# EAGLE design headset-btmodule (EAGLE 6.4)
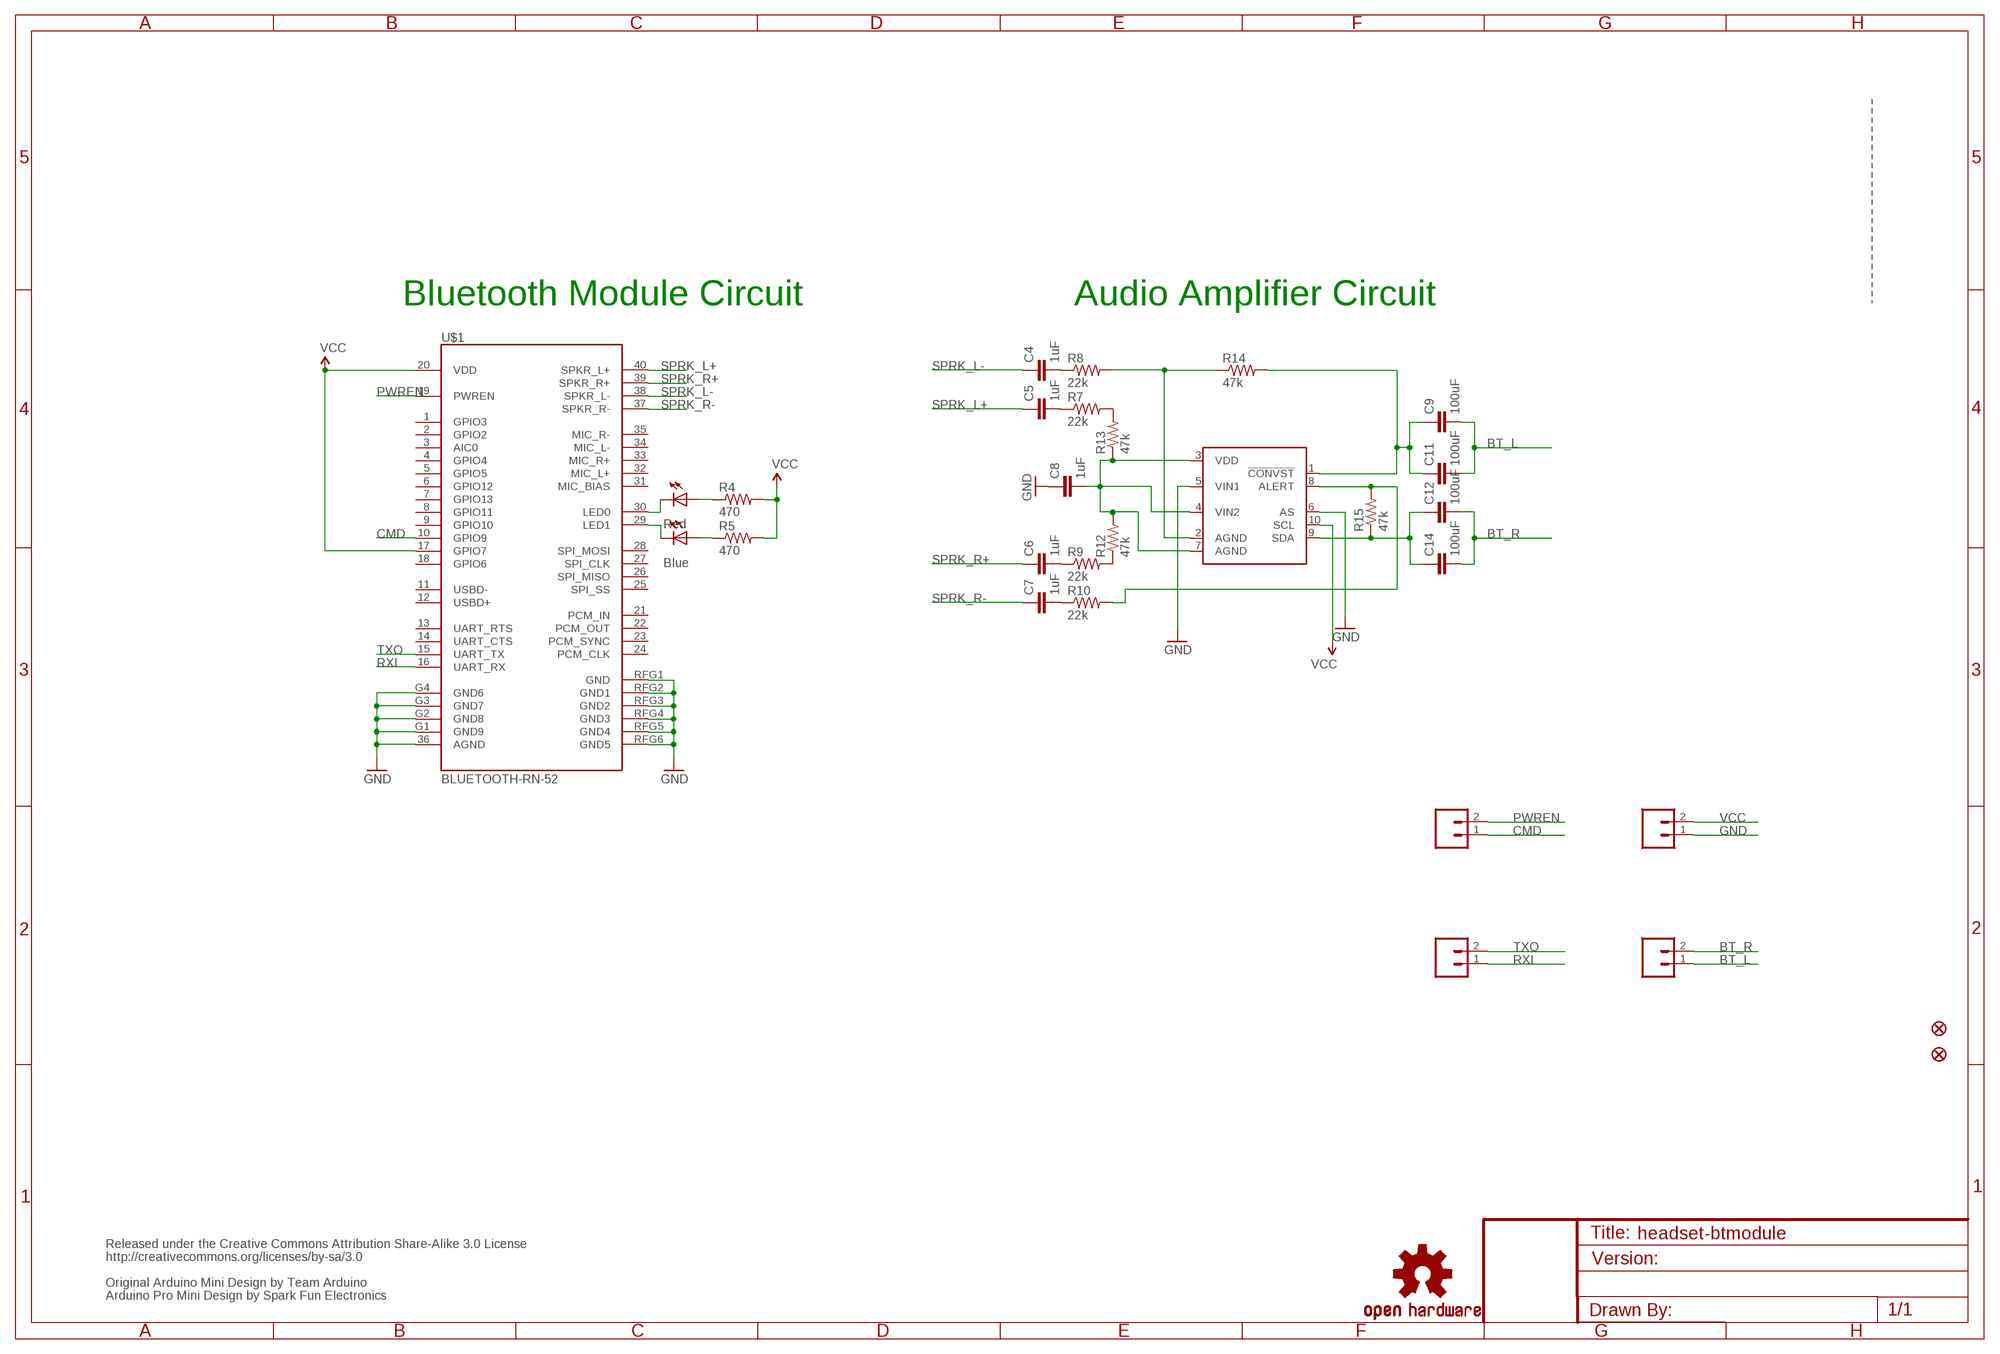
[diagram p0: schematic, sheet 1]

## Parts
AUDIO  M02PTH  [1X02]
C4  1uF  CAP0402-CAP  [0402-CAP]
C5  1uF  CAP0402-CAP  [0402-CAP]
C6  1uF  CAP0402-CAP  [0402-CAP]
C7  1uF  CAP0402-CAP  [0402-CAP]
C8  1uF  CAP0402-CAP  [0402-CAP]
C9  100uF  CAP0805  [0805]
C11  100uF  CAP0805  [0805]
C12  100uF  CAP0805  [0805]
C14  100uF  CAP0805  [0805]
CMD  M02PTH  [1X02]
JP5  FIDUCIALUFIDUCIAL  [MICRO-FIDUCIAL]
JP8  FIDUCIALUFIDUCIAL  [MICRO-FIDUCIAL]
LED3  Red  LED-3MM-NO_SILK  [LED3MM-NS]
LED4  Blue  LED-3MM-NO_SILK  [LED3MM-NS]
POWER  M02PTH  [1X02]
R4  470  RESISTOR0402-RES  [0402-RES]
R5  470  RESISTOR0402-RES  [0402-RES]
R7  22k  RESISTOR0402-RES  [0402-RES]
R8  22k  RESISTOR0402-RES  [0402-RES]
R9  22k  RESISTOR0402-RES  [0402-RES]
R10  22k  RESISTOR0402-RES  [0402-RES]
R12  47k  RESISTOR0402-RES  [0402-RES]
R13  47k  RESISTOR0402-RES  [0402-RES]
R14  47k  RESISTOR0402-RES  [0402-RES]
R15  47k  RESISTOR0402-RES  [0402-RES]
T  AD7992  [MSOP10]
TX  M02PTH  [1X02]
U$1  BLUETOOTH-RN-52  [RN-52]
U$3  OSHW-LOGOS  [OSHW-LOGO-S]

## Nets
BT_L: AUDIO.1 C9.2 C11.2
BT_R: AUDIO.2 C12.2 C14.2
CMD: CMD.1 U$1.10(GPIO9)
GND [vcc]: C8.1 POWER.1 T.5(VIN1) T.6(AS) U$1.36(AGND) U$1.G1(GND9) U$1.G2(GND8) U$1.G3(GND7) U$1.G4(GND6) U$1.RFG1(GND) U$1.RFG2(GND1) U$1.RFG3(GND2) U$1.RFG4(GND3) U$1.RFG5(GND4) U$1.RFG6(GND5)
N$3: LED3.A R4.1
N$4: LED4.A R5.1
N$5: LED3.K(C) U$1.30(LED0)
N$6: LED4.K(C) U$1.29(LED1)
N$21: C12.1 C14.1 R15.1 T.9(SDA)
N$22: R10.2 R15.2 T.8(ALERT)
N$23: R7.2 R13.2
N$24: C9.1 C11.1 R14.2 T.1(!CONVST)
N$26: R9.2 R12.1
N$27: C6.2 R9.1
N$28: C7.2 R10.1
N$29: C5.2 R7.1
N$49: C4.2 R8.1
N$50: C8.2 R12.2 R13.1 T.3(VDD) T.4(VIN2) T.7(AGND)
N$53: R8.2 R14.1 T.2(AGND)
PWREN: CMD.2 U$1.19(PWREN)
RXI: TX.1 U$1.16(UART_RX)
SPRK_L+: C5.1 U$1.40(SPKR_L+)
SPRK_L-: C4.1 U$1.38(SPKR_L-)
SPRK_R+: C6.1 U$1.39(SPKR_R+)
SPRK_R-: C7.1 U$1.37(SPKR_R-)
TXO: TX.2 U$1.15(UART_TX)
VCC: POWER.2 R4.2 R5.2 T.10(SCL) U$1.17(GPIO7) U$1.20(VDD)
Unconnected: U$1.1(GPIO3) U$1.2(GPIO2) U$1.3(AIC0) U$1.4(GPIO4) U$1.5(GPIO5) U$1.6(GPIO12) U$1.7(GPIO13) U$1.8(GPIO11) U$1.9(GPIO10) U$1.11(USBD-) U$1.12(USBD+) U$1.13(UART_RTS) U$1.14(UART_CTS) U$1.18(GPIO6) U$1.21(PCM_IN) U$1.22(PCM_OUT) U$1.23(PCM_SYNC) U$1.24(PCM_CLK) U$1.25(SPI_SS) U$1.26(SPI_MISO) U$1.27(SPI_CLK) U$1.28(SPI_MOSI) U$1.31(MIC_BIAS) U$1.32(MIC_L+) U$1.33(MIC_R+) U$1.34(MIC_L-) U$1.35(MIC_R-)

## Notes on the sheet
- Bluetooth Module Circuit | Audio Amplifier Circuit
- Released under the Creative Commons Attribution Share-Alike 3.0 License
- http://creativecommons.org/licenses/by-sa/3.0
- Original Arduino Mini Design by Team Arduino
- Arduino Pro Mini Design by Spark Fun Electronics

## Library data of the parts
AUDIO CMD POWER TX = SparkFun-Connectors:M02: Standard 2-pin 0.1" header. Use with - straight break away headers ( PRT-00116) - right angle break away headers (PRT-00553) - swiss pins (PRT-00743) - machine pins (PRT-00117) - female headers (PRT-00115) Molex polarized connector foot print use with: PRT-08233 with associated crimp pins and housings. 2.54_SCREWTERM for use with PRT-10571. 3.5mm Screw Terminal footprints for PRT-08084 5mm Screw Terminal footprints for use with PRT-08433
C4-C9 C11 C12 C14 = SparkFun-Passives:CAP: Capacitor Standard 0603 ceramic capacitor, and 0.1" leaded capacitor.
JP5 JP8 = SparkFun:FIDUCIAL: Fiducial Alignment Points Various fiducial points for machine vision alignment.
LED3 LED4 = SparkFun-LED:LED: LEDs Standard schematic elements and footprints for 5mm, 3mm, 1206, and 0603 sized LEDs. 5mm - Spark Fun Electronics SKU : COM-00529 (and others)
R4 R5 R7-R10 R12-R15 = SparkFun-Passives:RESISTOR: Resistor Basic schematic elements and footprints for 0603, 1206, and PTH resistors.
T = analog-devices:AD7992: 2-Channel, 12-Bit ADC with I2C-Compatible Interface 10-Lead MSOP Source: http://www.analog.com/UploadedFiles/Data_Sheets/224965274AD7992_0.pdf; MPN: AD7992BRMZ-0; OC_FARNELL: 1078311; OC_NEWARK: 31M4422
U$1 = SparkFun-RF:BLUETOOTH-RN-52
U$3 = SparkFun:OSHW-LOGO: Open Source Hardware Logo This logo indicates the piece of hardware it is found on incorporates a OSHW license and/or adheres to the definition of open source hardware found here: http://freedomdefined.org/OSHW

## Net classes
0 default: width 0.203 mm
1 vcc: width 0.254 mm

## Board
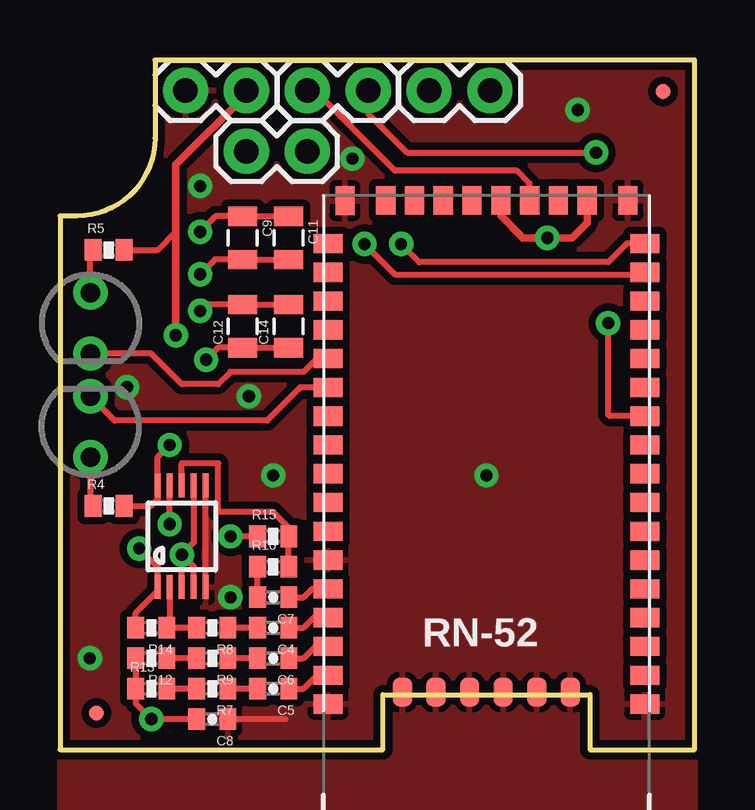
[diagram p1: board, top side]
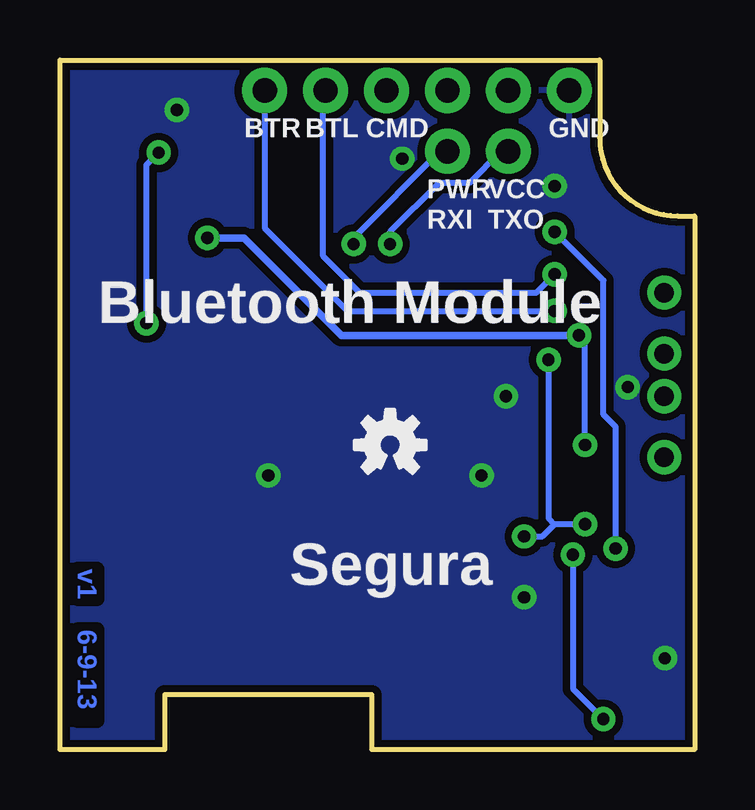
[diagram p2: board, bottom side, seen from below]

Size 26.47 x 28.75 mm. Coordinates in mm from the lower left corner, seen from the top.
Outline: 3.96,28.75 3.96,25.5 arc-90 0.71,22.25 0,22.25 0,0 13.46,0 13.46,2.29 22.1,2.29 22.1,0 26.47,0 26.47,28.75 3.96,28.75
Copper layers (1*16): Top 0.035mm / dielectric 1.5mm / Bottom 0.035mm
Design rules "default": minimum track width 8mil, minimum drill 20mil, track to track 8mil, track to pad 8mil, pad to pad 8mil, via to via 8mil, smd to smd 8mil, copper to edge 8mil, drill to drill 8mil, minimum pad ring 12mil, minimum via ring 10mil, stop-mask expansion 4mil, vias tented up to drill 20mil, thermal gap 10mil

### Footprints (pad centres in the part's own frame; a part is rotated, then mirrored left to right if it is on the bottom)
1X02 = drill 1.016 pad 1.88: 1 0,0; 2 2.54,0
0402-CAP = smd 0.7 x 0.9: 1 -0.65,0; 2 0.65,0
0805 = smd 0.8 x 1.2: 1 -0.9,0; 2 0.9,0
MICRO-FIDUCIAL = smd 0.635 x 0.635: 1 0,0
LED3MM-NS = drill 0.813: A -1.27,0; K 1.27,0
0402-RES = smd 0.7 x 0.9: 1 -0.65,0; 2 0.65,0
MSOP10 = smd 0.25 x 1: 1 -1,-2.113; 2 -0.5,-2.113; 3 0,-2.113; 4 0.5,-2.113; 5 1,-2.113; 6 1,2.113; 7 0.5,2.113; 8 0,2.113; 9 -0.5,2.113; 10 -1,2.113
RN-52 = smd 1.2 x 0.8: 1 -6.6,8.33; 2 -6.6,7.13; 3 -6.6,5.93; 4 -6.6,4.73; 5 -6.6,3.53; 6 -6.6,2.33; 7 -6.6,1.13; 8 -6.6,-0.07; 9 -6.6,-1.27; 10 -6.6,-2.47; 11 -6.6,-3.67; 12 -6.6,-4.87; 13 -6.6,-6.07; 14 -6.6,-7.27; 15 -6.6,-8.47; 16 -6.6,-9.67; 25 6.6,-9.67; 26 6.6,-8.47; 27 6.6,-7.27; 28 6.6,-6.07; 29 6.6,-4.87; 30 6.6,-3.67; 31 6.6,-2.47; 32 6.6,-1.27; 33 6.6,-0.07; 34 6.6,1.13; 35 6.6,2.33; 36 6.6,3.53; 37 6.6,4.73; 38 6.6,5.93; 39 6.6,7.13; 40 6.6,8.33; G1 -6.6,9.53; G4 6.6,9.53 | smd 0.8 x 1.2: 17 -4.2,-11.47; 18 -3,-11.47; 19 -1.8,-11.47; 20 -0.6,-11.47; 21 0.6,-11.47; 22 1.8,-11.47; 23 3,-11.47; 24 4.2,-11.47; G2 -5.9,-11.47; G3 5.9,-11.46; RFG1 -3.5,9.03; RFG2 -2.1,9.03; RFG3 -0.7,9.03; RFG4 0.7,9.03; RFG5 2.1,9.03; RFG6 3.5,9.03

### Placement (x,y rotation side)
AUDIO  15.39,27.48 0 top
C4  8.89,5.08 180 top
C5  8.89,2.54 180 top
C6  8.89,3.81 180 top
C7  8.89,6.35 180 top
C8  6.35,1.27 180 top
C9  7.62,21.34 270 top
C11  9.52,21.34 270 top
C12  7.62,17.65 90 top
C14  9.52,17.65 90 top
CMD  12.85,27.48 180 top
JP5  25.15,27.43 0 top
JP8  1.52,1.52 0 top
LED3  1.27,13.46 90 top
LED4  1.27,17.78 270 top
POWER  5.23,27.48 0 top
R4  2.03,10.16 0 top
R5  2.03,20.83 0 top
R7  6.35,2.54 180 top
R8  6.35,5.08 180 top
R9  6.35,3.81 180 top
R10  8.89,7.62 0 top
R12  3.81,3.81 180 top
R13  3.81,2.54 0 top
R14  3.81,5.08 180 top
R15  8.89,8.89 0 top
T  5.08,8.89 0 top
TX  10.31,24.94 180 top
U$1  17.78,11.43 180 top
U$3  12.7,12.7 0 bottom

### Tracks (layer width: path | path; a pad name or v marks a point on that pad's centre or on a via)
BT_L  (via drill 0.51)
  Top 0.254: C11.2 C9.2 6.47,20.44 v5.84,19.81
  Bottom 0.254: v5.84,19.81 6.6,19.05 13.97,19.05 15.49,20.57 15.49,27.38 AUDIO.1
BT_R  (via drill 0.51)
  Top 0.254: C14.2 C12.2 6.11,18.55 v5.84,18.29
  Bottom 0.254: v5.84,18.29 14.48,18.29 17.93,21.74 AUDIO.2
CMD  (via drill 0.51)
  Top 0.254: CMD.1 12.85,26.52 14.48,24.89 v22.35,24.89 | U$1.10 22.93,13.9 22.86,13.97 v22.86,17.78
  Bottom 0.254: v22.86,17.78 22.86,24.38 v22.35,24.89
GND  (via drill 0.51)
  Top 0.254: 9.4,1.27 C8.1 | T.5 T.6
  other vias: 21.59,26.67 2.79,15.11 7.87,14.73 5.84,23.49 17.78,11.43 8.89,11.43 1.24,3.81 12.19,24.64 7.11,6.35
  pour Top (isolate 0.305): 0,28.75 26.47,28.75 26.47,-15.24 0,-15.24
  pour Bottom (isolate 0.305): 0,28.75 26.47,28.75 26.47,-15.24 0,-15.24
N$3
  Top 0.254: LED3.A 1.27,10.27 R4.1
N$4
  Top 0.254: LED4.A 1.27,20.72 R5.1
N$5
  Top 0.254: U$1.30 10.02,15.1 8.64,13.72 2.29,13.72 LED3.K
N$6
  Top 0.254: U$1.29 10.71,16.3 10.16,15.75 7.11,15.75 6.6,15.24 5.08,15.24 3.81,16.51 LED4.K
N$21  (via drill 0.51)
  Top 0.254: C14.1 C12.1 6.59,16.75 v6.1,16.26 | R15.1 v7.11,8.89 | v4.57,9.4 T.9
  Bottom 0.254: v7.11,8.89 6.35,8.89 5.84,9.4 | v6.1,16.26 6.1,9.65 5.84,9.4 | v4.57,9.4 5.84,9.4
N$22
  Top 0.254: R10.2 R15.2 9.54,9.26 8.89,9.91 6.6,9.91 6.6,11.94 5.08,11.94 T.8
N$23
  Top 0.254: R7.2 R13.2
N$24  (via drill 0.51)
  Top 0.254: C11.1 C9.1 6.49,22.24 v5.84,21.59 | R14.2 3.16,5.7 4.08,6.62 T.1 4.08,7.6 v3.3,8.38
  Bottom 0.254: v3.3,8.38 3.3,13.46 3.81,13.97 3.81,19.56 v5.84,21.59
N$26
  Top 0.254: R9.2 R12.1
N$27
  Top 0.254: C6.2 R9.1
N$28
  Top 0.254: C7.2 R10.1
N$29
  Top 0.254: C5.2 R7.1
N$49
  Top 0.254: C4.2 R8.1
N$50  (via drill 0.51)
  Top 0.254: T.7 5.58,8.63 v5.08,8.13 | T.4 5.58,7.63 v5.08,8.13 | T.3 v5.08,8.13 | R12.2 R13.1 3.16,1.92 v3.81,1.27 C8.2
  Bottom 0.254: v5.08,8.13 5.08,2.54 v3.81,1.27
N$53
  Top 0.254: R8.2 R14.1 4.58,5.2 T.2
PWREN
  Top 0.254: U$1.19 19.58,23.6 19.05,24.13 13.97,24.13 10.62,27.48 CMD.2
RXI  (via drill 0.51)
  Top 0.254: v14.22,21.08 14.99,20.32 22.86,20.32 23.64,21.1 U$1.16
  Bottom 0.254: v14.22,21.08 14.22,21.34 10.62,24.94 TX.1
SPRK_L+
  Top 0.254: C5.1 10.16,2.54 10.72,3.1 U$1.40
SPRK_L-
  Top 0.254: C4.1 10.16,5.08 10.58,5.5 U$1.38
SPRK_R+
  Top 0.254: C6.1 10.16,3.81 10.65,4.3 U$1.39
SPRK_R-
  Top 0.254: C7.1 10.16,6.35 10.51,6.7 U$1.37
TXO  (via drill 0.51)
  Top 0.254: v12.7,21.08 13.97,19.81 24.38,19.81 U$1.15
  Bottom 0.254: v12.7,21.08 12.7,21.59 10.67,23.62 9.4,23.62 8.08,24.94 TX.2
VCC  (via drill 0.51)
  Top 0.254: v4.57,12.7 4.08,12.21 T.10 4.08,10.43 3.81,10.16 R4.2 | R5.2 4.06,20.83 4.83,21.59
  Top 0.305: POWER.2 7.77,27.33 4.83,24.38 4.83,21.59 v4.83,17.27 | U$1.17 21.98,21.98 21.34,21.34 v20.32,21.34 19.3,21.34 18.38,22.26 U$1.20
  Bottom 0.254: v4.57,12.7 4.57,17.02 v4.83,17.27
  Bottom 0.305: v4.83,17.27 14.73,17.27 18.8,21.34 v20.32,21.34

### Text on the board
Bottom: v1 | 6-9-13
tPlace: RN-52
bPlace: GND | CMD | BTL | BTR | VCC | PWR | TXO | RXI | Bluetooth Module | Segura
tValues: Valid combinations: | 168V / 3.3V Reg / 8MHz | 168 / 5V Reg / 16MHz | 168 / 5V Reg / 20MHz | Mark back accordingly | Arduino Pro Mini